# Altium schematic sheet CAN.SchDoc: CAN.SchDoc
size A4
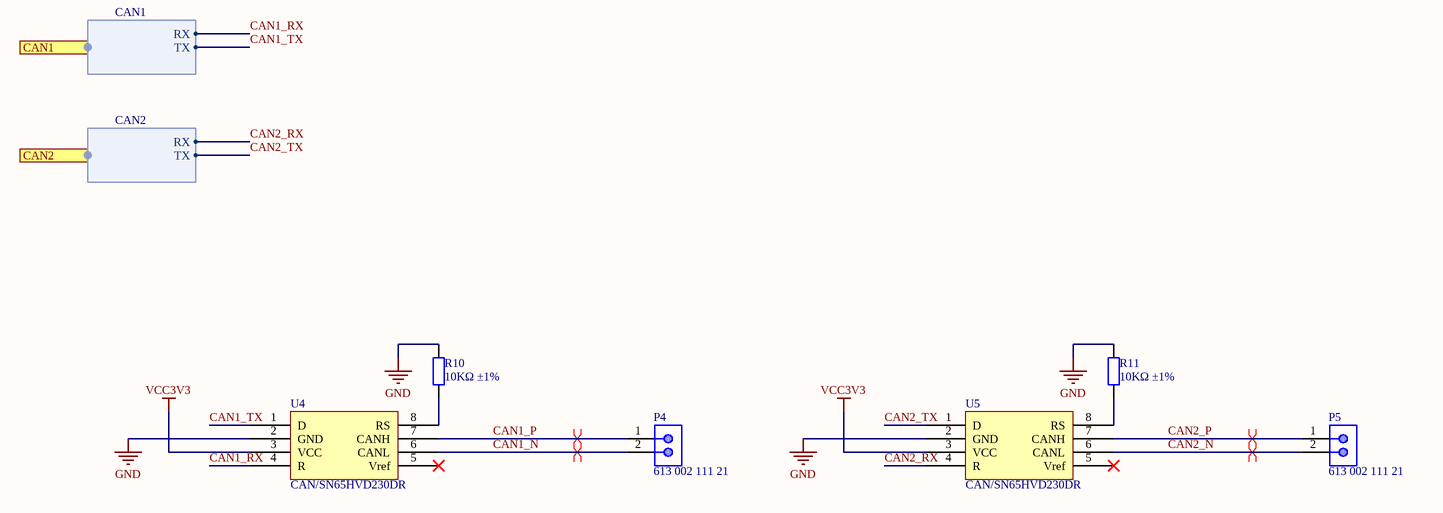
[diagram p0: CAN.SchDoc]

## Parts
P4  613 002 111 21  [WE-61300211121_V]
P5  613 002 111 21  [WE-61300211121_V]
R10  10KΩ ±1%  [0402_R]
R11  10KΩ ±1%  [0402_R]
U4  CAN/SN65HVD230DR  [SOIC-8_150mil]
U5  CAN/SN65HVD230DR  [SOIC-8_150mil]

## Ports
CAN1 (harness CAN1), CAN2 (harness CAN2)

## Harnesses
CAN1: RX, TX
CAN2: RX, TX

## Nets
GND: R10.2 R11.2 U4.2(GND) U5.2(GND)
VCC3V3: U4.3(VCC) U5.3(VCC)
CAN1_N: P4.2 U4.6(CANL)
CAN1_P: P4.1 U4.7(CANH)
CAN1_RX: U4.4(R) ; port CAN1.RX
CAN1_TX: U4.1(D) ; port CAN1.TX
CAN2_N: P5.2 U5.6(CANL)
CAN2_P: P5.1 U5.7(CANH)
CAN2_RX: U5.4(R) ; port CAN2.RX
CAN2_TX: U5.1(D) ; port CAN2.TX
NetR10_1: R10.1 U4.8(RS)
NetR11_1: R11.1 U5.8(RS)

Not connected (* = marked no-connect by the designer): U4 5(Vref)*; U5 5(Vref)*

## Layout directives
differential pair: CAN1_N, CAN1_P, CAN2_N, CAN2_P

## Notes on the sheet
- Title
- Size:
- Date:
- A4
- Number:
- Time:
- Revision:
- Sheet
- of
- File:

## Library data of the parts
P4 P5 = CMP-1712-00002-3: Male Header, Pitch 2.54 mm, 1 x 2 Position, Height 8.54 mm, Tail Length 3 mm, -40 to 105 degC, RoHS, Bulk; Mounting Technology: Through Hole; Packaging: Bulk; Pins: 2; REACH SVHC: No SVHC; PartNumber: 613 002 111 21; PackageDescription: Male Header, Pitch 2.54 mm, 1 x 2 Position, Height 8.54 mm, Tail Length 3 mm; ComponentLink1Description: Manufacturer URL; Max Operating Temperature: 125 degC; ComponentLink1URL: https://www.we-online.com/; ComponentLink2Description: Datasheet; Mount: Through Hole; DatasheetVersion: Rev. J; Min Operating Temperature: -40 degC; ComponentLink2URL: http://katalog.we-online.de/em/datasheet/6130xx11121.pdf; RoHSCompliant: True
R10 R11 = 0402 10K (1002) 1%: Chip resistor; Manufacturer: Uniroyal Elec; PartNumber: 0402WGF1002TCE; Power: 1/16W; ComponentLink1Description: Supplier link; ComponentLink1URL: http://www.szlcsc.com/product/details_26487.html; Package: 0402; Supplier: LC; SuppliersPartNumber: C25744; Resistance: 10KΩ; Tolerance: 1%
U4 U5 = CAN/SN65HVD230DR_[C12084]: CAN; ComponentLink1Description: 供应商链接; ComponentLink1URL: http://www.szlcsc.com/product/details_12661.html; Package: SOIC-8_150mil; Supplier: LC; SuppliersPartNumber: C12084